# EAGLE schematic AC (EAGLE 6.4)
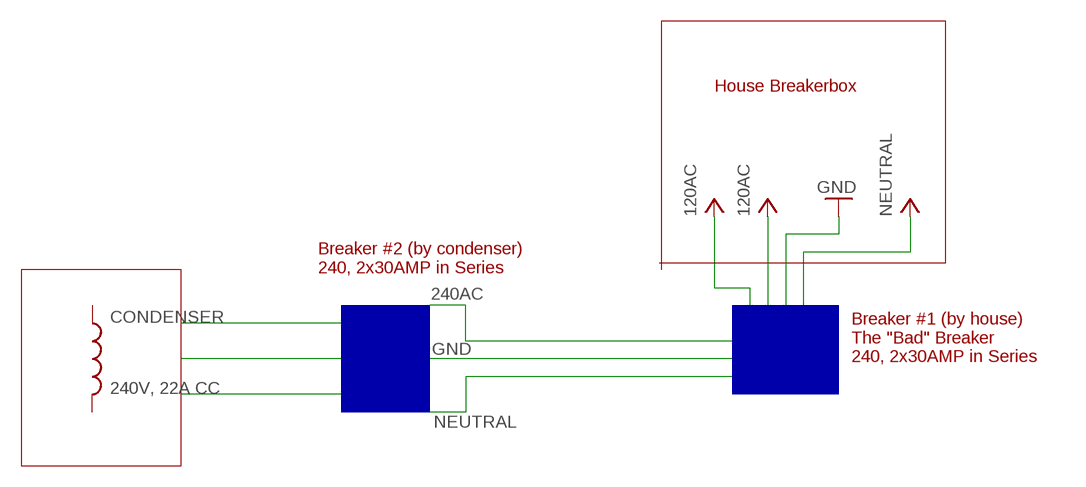
[diagram p0: schematic, sheet 1]

## Parts
CONDENSER  240V, 22A CC  INDUCTOR1007  [1007]
Unconnected: CONDENSER.1 CONDENSER.2

## Notes on the sheet
- House Breakerbox
- Breaker #2 (by condenser)
  240, 2x30AMP in Series
- Breaker #1 (by house)
  The "Bad" Breaker
  240, 2x30AMP in Series

## Library data of the parts
CONDENSER = SparkFun:INDUCTOR: Inductors Basic Inductor/Choke - 0603 and 1206. Footprints are not proven and vary greatly between part numbers.